# EAGLE design PLCC32 programmer (EAGLE 9.1.0)
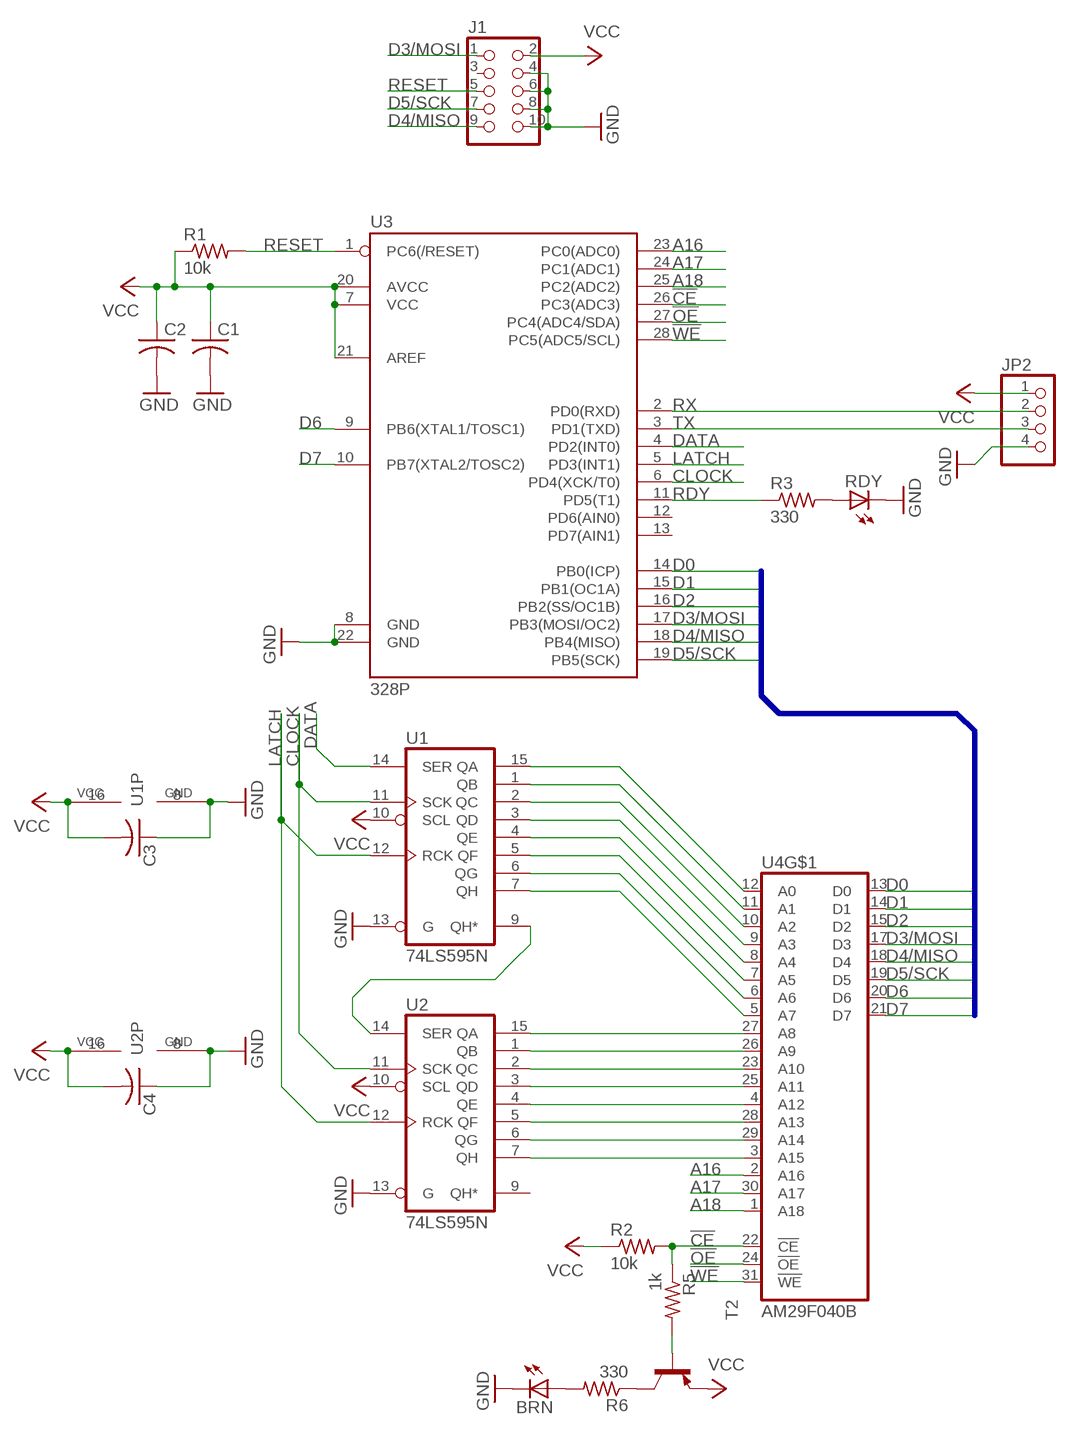
[diagram p0: schematic, sheet 1]

## Parts
BRN  LED5MM  [LED5MM]
C1  C-US025-024X044  [C025-024X044]
C2  C-US025-024X044  [C025-024X044]
C3  C-US025-024X044  [C025-024X044]
C4  C-US025-024X044  [C025-024X044]
J1  CON_HEADER_2X05-PTH+SHROUDED_A  [PINSHRD_PTH_2X05]
JP2  PINHD-1X4/OCT  [1X04/OCT]
R1  10k  R-US_0204/7  [0204/7]
R2  10k  R-US_0204/7  [0204/7]
R3  330  R-US_0204/7  [0204/7]
R5  1k  R-US_0204/7  [0204/7]
R6  330  R-US_0204/7  [0204/7]
RDY  LED5MM  [LED5MM]
T2  BC558A-PNP-TO92-EBC  [TO92-EBC]
U1  74LS595N  [DIL16]
U2  74LS595N  [DIL16]
U3  328P  ATMEGA328P_PDIP  [DIP28]
U4  AM29F040B  [PLCC-32-SMT-TT]

## Nets
!CE: R2.2 R5.1 U3.26(PC3(ADC3)) U4.22(!CE)
!OE: U3.27(PC4(ADC4/SDA)) U4.24(!OE)
!WE: U3.28(PC5(ADC5/SCL)) U4.31(!WE)
A16: U3.23(PC0(ADC0)) U4.2(A16)
A17: U3.24(PC1(ADC1)) U4.30(A17)
A18: U3.25(PC2(ADC2)) U4.1(A18)
CLOCK: U1.11(SCK) U2.11(SCK) U3.6(PD4(XCK/T0))
D0: U3.14(PB0(ICP)) U4.13(D0)
D1: U3.15(PB1(OC1A)) U4.14(D1)
D2: U3.16(PB2(SS/OC1B)) U4.15(D2)
D3/MOSI: J1.1 U3.17(PB3(MOSI/OC2)) U4.17(D3)
D4/MISO: J1.9 U3.18(PB4(MISO)) U4.18(D4)
D5/SCK: J1.7 U3.19(PB5(SCK)) U4.19(D5)
D6: U3.9(PB6(XTAL1/TOSC1)) U4.20(D6)
D7: U3.10(PB7(XTAL2/TOSC2)) U4.21(D7)
DATA: U1.14(SER) U3.4(PD2(INT0))
GND: BRN.K(C) C1.2 C2.2 C3.1 C4.1 J1.4 J1.6 J1.8 J1.10 JP2.4 RDY.K(C) U1.8(GND) U1.13(G) U2.8(GND) U2.13(G) U3.8(GND) U3.22(GND)
LATCH: U1.12(RCK) U2.12(RCK) U3.5(PD3(INT1))
N$1: U1.9(QH*) U2.14(SER)
N$2: U1.15(QA) U4.12(A0)
N$3: U1.1(QB) U4.11(A1)
N$4: U1.2(QC) U4.10(A2)
N$5: U1.3(QD) U4.9(A3)
N$6: U1.4(QE) U4.8(A4)
N$7: U1.5(QF) U4.7(A5)
N$8: U1.6(QG) U4.6(A6)
N$9: U1.7(QH) U4.5(A7)
N$10: U2.15(QA) U4.27(A8)
N$11: U2.1(QB) U4.26(A9)
N$12: U2.2(QC) U4.23(A10)
N$13: U2.3(QD) U4.25(A11)
N$14: U2.4(QE) U4.4(A12)
N$15: U2.5(QF) U4.28(A13)
N$16: U2.6(QG) U4.29(A14)
N$17: U2.7(QH) U4.3(A15)
N$18: R3.2 RDY.A
N$22: R6.1 T2.C
N$23: BRN.A R6.2
N$24: R5.2 T2.B
RDY: R3.1 U3.11(PD5(T1))
RESET: J1.5 R1.2 U3.1(PC6(/RESET))
RX: JP2.2 U3.2(PD0(RXD))
TX: JP2.3 U3.3(PD1(TXD))
VCC: C1.1 C2.1 C3.2 C4.2 J1.2 JP2.1 R1.1 R2.1 T2.E U1.10(SCL) U1.16(VCC) U2.10(SCL) U2.16(VCC) U3.7(VCC) U3.20(AVCC) U3.21(AREF)
Unconnected: J1.3 U2.9(QH*) U3.12(PD6(AIN0)) U3.13(PD7(AIN1))

## Buses
D0,D1,D2,D3/MOSI,D4/MISO,D5/SCK,D6,D7

## Power pins joined to a net without a drawn wire
GND: U4.16(GND)
VCC: U4.32(VCC)

## Library data of the parts
BRN RDY = led:LED: LED OSRAM: - CHIPLED LG R971, LG N971, LY N971, LG Q971, LY Q971, LO R971, LY R971 LH N974, LH R974 LS Q976, LO Q976, LY Q976 LO Q996 - Hyper CHIPLED LW Q18S LB Q993, LB Q99A, LB R99A - SideLED LS A670, LO A670, LY A670, LG A670, LP A670 LB A673, LV A673, LT A673, LW A673 LH A674 LY A675 LS A676, LA A676, LO A676, LY A676, LW A676 LS A679, LY A679, LG A679 - Hyper Micro SIDELED® LS Y876, LA Y876, LO Y876, LY Y876 LT Y87S - SmartLED LW L88C, LW L88S LB L89C, LB L89S, LG L890 LS L89K, LO L89K, LY L89K LS L896, LA L896, LO L896, LY L896 - TOPLED LS T670, LO T670, LY T670, LG T670, LP T670 LSG T670, LSP T670, LSY T670, LOP T670, LYG T670 LG T671, LOG T671, LSG T671 LB T673, LV T673, LT T673, LW T673 LH T674 LS T676, LA T676, LO T676, LY T676, LB T676, LH T676, LSB T676, LW T676 LB T67C, LV T67C, LT T67C, LS T67K, LO T67K, LY T67K, LW E67C LS E67B, LA E67B, LO E67B, LY E67B, LB E67C, LV E67C, LT E67C LW T67C LS T679, LY T679, LG T679 LS T770, LO T770, LY T770, LG T770, LP T770 LB T773, LV T773, LT T773, LW T773 LH T774 LS E675, LA E675, LY E675, LS T675 LS T776, LA T776, LO T776, LY T776, LB T776 LHGB T686 LT T68C, LB T68C - Hyper Mini TOPLED® LB M676 - Mini TOPLED Santana® LG M470 LS M47K, LO M47K, LY M47K Source: http://www.osram.convergy.de LUXEON: - LUMILED® LXK2-PW12-R00, LXK2-PW12-S00, LXK2-PW14-U00, LXK2-PW14-V00 LXK2-PM12-R00, LXK2-PM12-S00, LXK2-PM14-U00 LXK2-PE12-Q00, LXK2-PE12-R00, LXK2-PE12-S00, LXK2-PE14-T00, LXK2-PE14-U00 LXK2-PB12-K00, LXK2-PB12-L00, LXK2-PB12-M00, LXK2-PB14-N00, LXK2-PB14-P00, LXK2-PB14-Q00 LXK2-PR12-L00, LXK2-PR12-M00, LXK2-PR14-Q00, LXK2-PR14-R00 LXK2-PD12-Q00, LXK2-PD12-R00, LXK2-PD12-S00 LXK2-PH12-R00, LXK2-PH12-S00 LXK2-PL12-P00, LXK2-PL12-Q00, LXK2-PL12-R00 Source: www.luxeon.com KINGBRIGHT: KA-3528ASYC Source: www.kingbright.com
C1-C4 = rcl:C-US: CAPACITOR, American symbol
J1 = dp_devices.v6:CON_HEADER_2X05: 2x05 pin header
JP2 = pinhead_v2:PINHD-1X4: PIN HEADER
R1-R3 R5 R6 = rcl:R-US_: RESISTOR, American symbol
T2 = transistor:*-PNP-: PNP Transistror
U1 = 74xx-us:74*595: 8-bit SHIFT REGISTER, output latch; SPICEPREFIX: X
U2 = 74xx-us:74*595: 8-bit SHIFT REGISTER, output latch
U3 = SparkFun-IC-Microcontroller:ATMEGA328P_PDIP: Atmel 328P Through hole ATMEGA328P uC used in the Arduino 32kb flash, 1k EEPROM, 2k SRAM Datasheet <http://www.sparkfun.com/datasheets/Components/SMD/ATMega328.pdf> SparkFun Products Storefront component: AVR 28 Pin 20MHz 32K 6A/D - ATMega328P <https://www.sparkfun.com/products/9061> (COM-09061) SparkFun Simon Says - Through-Hole Soldering Kit <https://www.sparkfun.com/products/10547> (KIT-10547) SparkFun Learn to Solder - Simon Says <https://www.sparkfun.com/products/13708> (KIT-13708) SparkFun BigTime Watch Kit <https://www.sparkfun.com/products/11734> (KIT-11734) SparkFun ClockIt <https://www.sparkfun.com/products/10930> (KIT-10930) SparkFun Serial Enabled LCD Kit <https://www.sparkfun.com/products/10097> (LCD-10097) SparkFun Simon Tilts - Through Hole Soldering Kit <https://www.sparkfun.com/products/12634> (KIT-12634) SparkFun Frequency Counter Kit <https://www.sparkfun.com/products/10140> (KIT-10140) FabFM Radio Kit <https://www.sparkfun.com/products/11043> (KIT-11043) SparkFun Binary Blaster Kit <https://www.sparkfun.com/products/12037> (KIT-12037) SparkFun Metro-Gnome <https://www.sparkfun.com/products/9236> (KIT-09236) ATmega328 with Arduino Optiboot (Uno) <https://www.sparkfun.com/products/10524> (DEV-10524); PROD_ID: IC-09136
U4 = am29F32B:AM29F040B

## Board
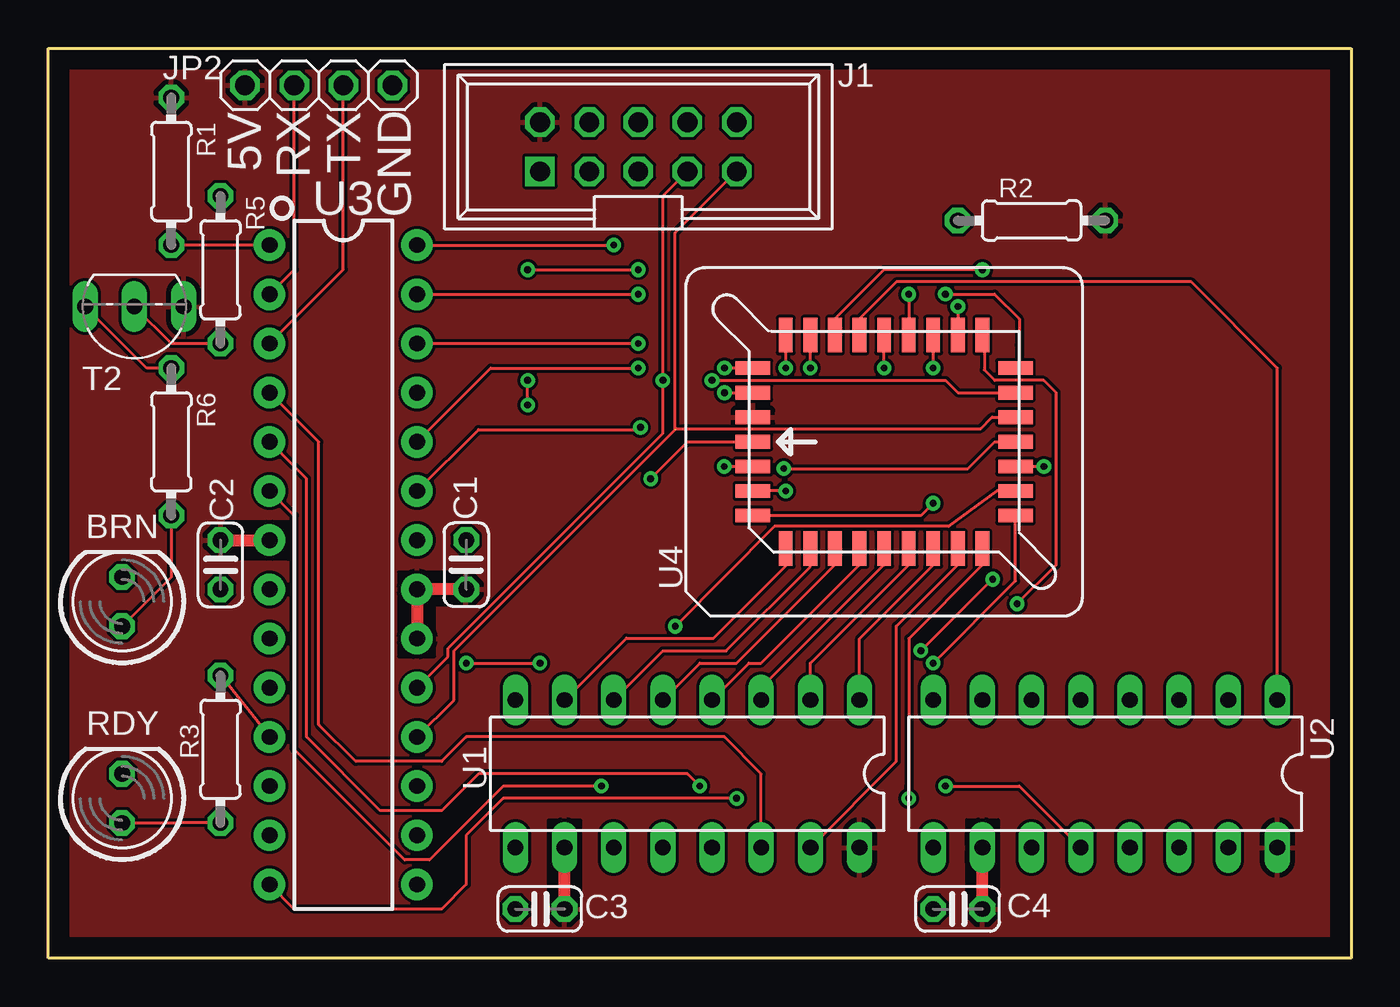
[diagram p1: board, top side]
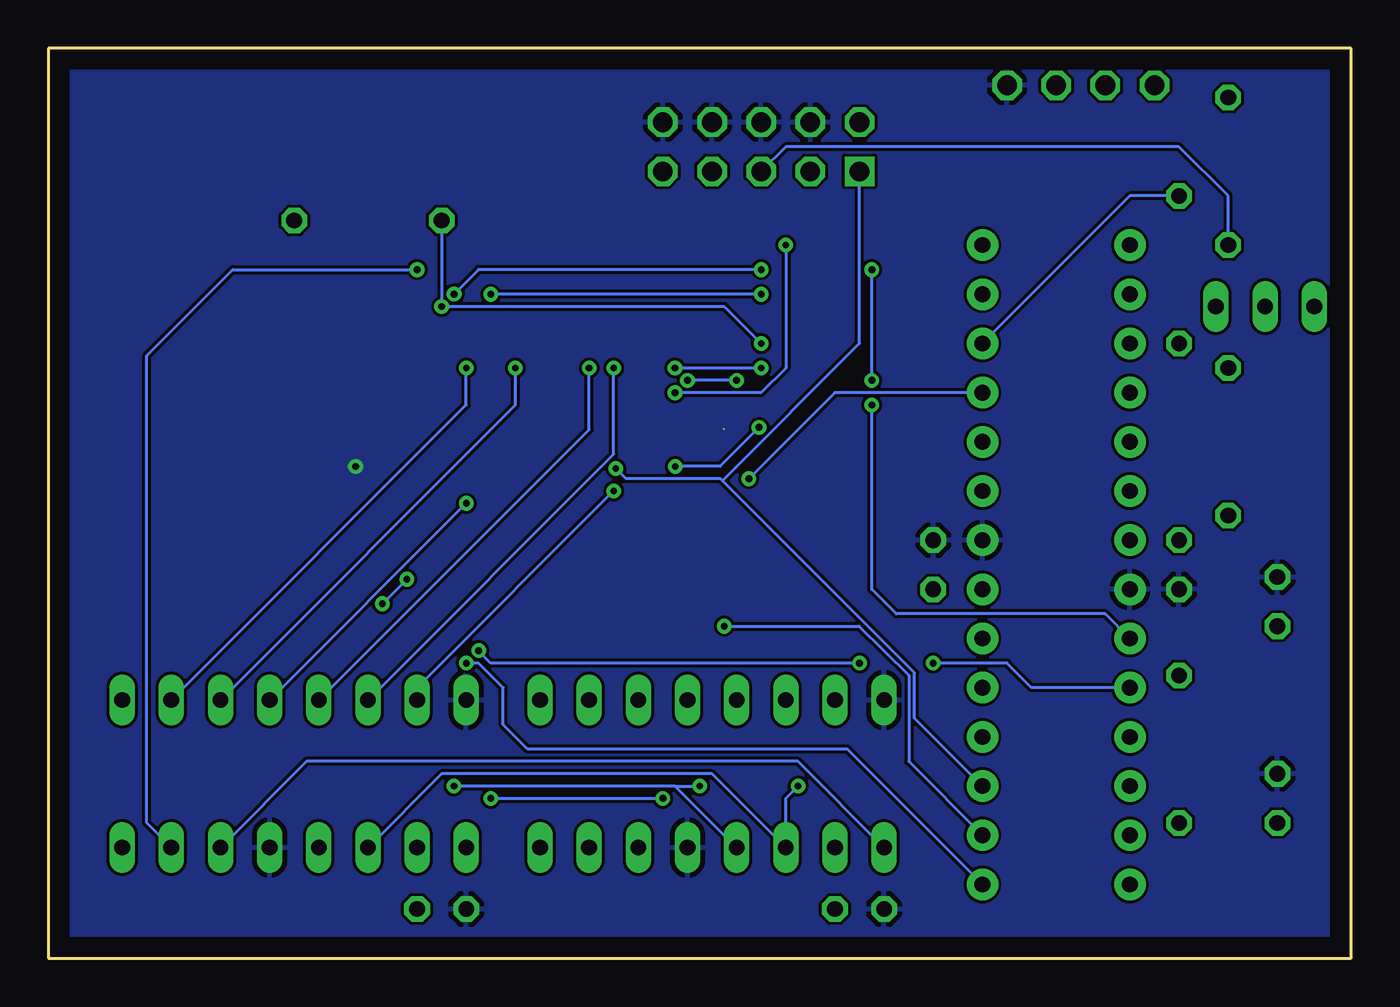
[diagram p2: board, bottom side, seen from below]

Size 67.31 x 46.99 mm. Coordinates in mm from the lower left corner, seen from the top.
Outline: 0,0 0,46.99 67.31,46.99 67.31,0 0,0
Copper layers (1*16): Top 0.035mm / dielectric 1.5mm / Bottom 0.035mm
Design rules "default": minimum track width 6mil, minimum drill 0.35mm, track to track 6mil, track to pad 6mil, pad to pad 6mil, via to via 6mil, smd to smd 6mil, copper to edge 40mil, drill to drill 6mil, minimum pad ring 10mil, minimum via ring 8mil, stop-mask expansion 4mil, vias tented up to drill 0mil, thermal gap 10mil

### Footprints (pad centres in the part's own frame; a part is rotated, then mirrored left to right if it is on the bottom)
LED5MM = drill 0.813 octagon: A -1.27,0; K 1.27,0
C025-024X044 = drill 0.813 octagon: 1 -1.27,0; 2 1.27,0
PINSHRD_PTH_2X05 = drill 1.016 square: 1 -5.08,-1.27 | drill 1.016 octagon: 2 -5.08,1.27; 3 -2.54,-1.27; 4 -2.54,1.27; 5 0,-1.27; 6 0,1.27; 7 2.54,-1.27; 8 2.54,1.27; 9 5.08,-1.27; 10 5.08,1.27
1X04/OCT = drill 1.016 octagon: 1 -3.81,0; 2 -1.27,0; 3 1.27,0; 4 3.81,0
0204/7 = drill 0.813 octagon: 1 -3.81,0; 2 3.81,0
TO92-EBC = drill 0.813 long: B 0,-1.27; C 2.54,-1.27; E -2.54,-1.27
DIL16 = drill 0.813 long: 1 -8.89,-3.81; 2 -6.35,-3.81; 3 -3.81,-3.81; 4 -1.27,-3.81; 5 1.27,-3.81; 6 3.81,-3.81; 7 6.35,-3.81; 8 8.89,-3.81; 9 8.89,3.81; 10 6.35,3.81; 11 3.81,3.81; 12 1.27,3.81; 13 -1.27,3.81; 14 -3.81,3.81; 15 -6.35,3.81; 16 -8.89,3.81
DIP28 = drill 0.813 pad 1.626: 1 -16.51,-3.81; 2 -13.97,-3.81; 3 -11.43,-3.81; 4 -8.89,-3.81; 5 -6.35,-3.81; 6 -3.81,-3.81; 7 -1.27,-3.81; 8 1.27,-3.81; 9 3.81,-3.81; 10 6.35,-3.81; 11 8.89,-3.81; 12 11.43,-3.81; 13 13.97,-3.81; 14 16.51,-3.81; 15 16.51,3.81; 16 13.97,3.81; 17 11.43,3.81; 18 8.89,3.81; 19 6.35,3.81; 20 3.81,3.81; 21 1.27,3.81; 22 -1.27,3.81; 23 -3.81,3.81; 24 -6.35,3.81; 25 -8.89,3.81; 26 -11.43,3.81; 27 -13.97,3.81; 28 -16.51,3.81
PLCC-32-SMT-TT = smd 0.71 x 1.78: 1 0,6.785; 2 -1.27,6.785; 3 -2.54,6.785; 4 -3.81,6.785; 14 -3.81,-6.785; 15 -2.54,-6.785; 16 -1.27,-6.785; 17 0,-6.785; 18 1.27,-6.785; 19 2.54,-6.785; 20 3.81,-6.785; 30 3.81,6.785; 31 2.54,6.785; 32 1.27,6.785 | smd 1.78 x 0.71: 5 -5.515,5.08; 6 -5.515,3.81; 7 -5.515,2.54; 8 -5.515,1.27; 9 -5.515,0; 10 -5.515,-1.27; 11 -5.515,-2.54; 12 -5.515,-3.81; 13 -5.515,-5.08; 21 5.515,-5.08; 22 5.515,-3.81; 23 5.515,-2.54; 24 5.515,-1.27; 25 5.515,0; 26 5.515,1.27; 27 5.515,2.54; 28 5.515,3.81; 29 5.515,5.08

### Placement (x,y rotation side)
BRN  3.81,18.41 90 top
C1  21.59,20.32 90 top
C2  8.89,20.32 270 top
C3  25.4,2.54 0 top
C4  46.99,2.54 0 top
J1  30.48,41.91 0 top
JP2  13.97,45.09 0 top
R1  6.35,40.64 270 top
R2  50.8,38.1 180 top
R3  8.89,10.79 270 top
R5  8.89,35.56 270 top
R6  6.35,26.67 270 top
RDY  3.81,8.26 90 top
T2  4.45,32.38 180 top
U1  33.02,9.53 180 top
U2  54.61,9.53 180 top
U3  15.24,20.32 270 top
U4  43.18,26.67 90 top

### Tracks (layer width: path | path; a pad name or v marks a point on that pad's centre or on a via)
!CE  (via drill 0.35)
  Top 0.152: v46.99,33.66 U4.22 | U3.26 v30.48,31.75
  Bottom 0.152: R5.1 11.43,39.37 U3.26 | R2.2 v46.99,33.66 32.38,33.66 v30.48,31.75
!OE  (via drill 0.35)
  Top 0.152: U3.27 v30.48,34.29 | v44.45,34.29 U4.24
  Bottom 0.152: v30.48,34.29 v44.45,34.29
!WE  (via drill 0.35)
  Top 0.152: U3.28 v29.21,36.83 | v34.93,29.2 v34.94,29.21 U4.31
  Bottom 0.152: v29.21,36.83 29.21,30.48 30.48,29.21 v34.92,29.21 v34.93,29.2
A16  (via drill 0.35)
  Top 0.152: U3.23 22.23,27.3 30.48,27.3 v30.59,27.42 | v34.92,25.4 U4.2
  Bottom 0.152: v30.59,27.42 32.61,25.4 v34.92,25.4
A17  (via drill 0.35)
  Top 0.152: U3.24 22.86,30.48 v30.48,30.48 | v34.93,30.49 U4.30
  Bottom 0.152: v30.48,30.48 v34.92,30.48 v34.93,30.49
A18  (via drill 0.35)
  Top 0.152: v31.11,24.77 33.02,26.67 U4.1
  Bottom 0.152: U3.25 26.67,29.21 v31.11,24.77
BLAH2
  cutout Top: 25.83,2.77 25.83,7.14 27.51,7.14 27.51,2.82 27.51,2.74 25.81,2.74 25.81,2.77
  cutout Top: 47.45,2.82 47.45,7.16 49.07,7.16 49.07,2.82
  cutout Top: 21.36,19.84 21.36,19.94 18.08,19.94 18.08,15.57 19.96,15.57 19.96,18.26 21.34,18.26 21.34,19.79 21.34,19.89 21.34,19.94
  cutout Top: 9.17,22.56 12.34,22.56 12.34,20.6 9.17,20.6
CLOCK  (via drill 0.35)
  Top 0.152: v28.57,8.89 23.5,8.89 19.68,5.08 18.41,5.08 12.7,10.79 12.7,22.86 U3.6
  Bottom 0.152: U2.11 46.99,9.53 33.02,9.53 U1.11 29.21,8.26 v28.57,8.89
D0  (via drill 0.35)
  Top 0.152: U4.13 48.26,20.32 44.45,16.51 44.45,8.89 v44.45,8.26 | v35.56,8.26 23.5,8.26 21.59,6.35 21.59,3.81 20.32,2.54 12.7,2.54 U3.14
  Bottom 0.152: v44.45,8.26 v35.56,8.26
D1  (via drill 0.35)
  Top 0.152: v45.72,15.24 49.97,19.48 U4.14
  Bottom 0.152: U3.15 26.04,10.79 42.55,10.79 43.81,12.06 43.81,13.97 45.09,15.24 v45.72,15.24
D2  (via drill 0.35)
  Top 0.152: U4.15 49,24.13 46.51,22.3 37.52,22.3 v32.39,17.15
  Bottom 0.152: v32.39,17.15 25.43,17.15 22.86,14.61 22.86,10.16 U3.16
D3/MOSI  (via drill 0.35)
  Top 0.152: v37.99,25.29 47.51,25.29 48.9,26.67 U4.17
  Bottom 0.152: U3.17 22.55,12.39 22.55,14.73 32.49,24.66 | 32.49,24.66 32.59,24.77 37.47,24.77 v37.99,25.29 | v37.99,25.29 38.1,25.4 v37.99,25.29 | 32.49,24.66 25.4,31.75 J1.1
D4/MISO  (1 unrouted)
  Top 0.152: U4.18 48.76,27.94 48.17,27.36 32.44,27.36 | J1.9 32.38,37.47 32.38,27.3 20.95,15.88 20.95,13.34 U3.18
D5/SCK  (via drill 0.35)
  Top 0.152: U3.19 20.65,15.57 20.65,16 31.75,27.1 v31.75,29.84 31.75,39.37 J1.7 | v34.29,29.84 46.35,29.84 46.99,29.21 U4.19
  Bottom 0.152: v31.75,29.84 v34.29,29.84
D6  (via drill 0.35)
  Top 0.152: v24.77,28.57 v24.77,29.84 | v24.77,35.56 v30.48,35.56 | v46.35,34.3 48.89,34.3 50.16,33.02 50.16,31.68 50.16,30.68 U4.20
  Bottom 0.152: U3.9 12.7,17.78 23.5,17.78 24.77,19.05 v24.77,28.57 | v24.77,29.84 v24.77,35.56 | v30.48,35.56 45.09,35.56 v46.35,34.3 | v46.35,34.3 v46.35,34.29 v46.35,34.3
D7  (via drill 0.35)
  Top 0.152: v21.59,15.24 v25.4,15.24 | v45.08,15.88 48.88,19.68 48.9,19.68 v48.78,19.57 | v50.05,18.3 52.07,20.32 52.07,29.21 51.43,29.85 48.89,29.85 48.36,30.38 48.36,32.28 | 48.46,32.38 48.36,32.28 | 48.36,32.28 U4.21
  Bottom 0.152: U3.10 16.51,13.97 17.78,15.24 v21.59,15.24 | v25.4,15.24 44.45,15.24 v45.09,15.88 v45.08,15.88 | v48.78,19.57 49.94,18.41 50.16,18.41 v50.05,18.3
DATA
  Top 0.152: U1.14 36.83,9.53 34.92,11.43 21.59,11.43 20.32,10.16 15.88,10.16 13.97,12.06 13.97,26.67 U3.4
GND  (via drill 0.35)
  Top 0.152: 50.8,25.4 U4.16 v51.44,25.4
  pour Bottom: 0,0 0,46.99 67.31,46.99 67.31,0
LATCH  (via drill 0.35)
  Top 0.152: v46.35,8.89 50.16,8.89 U2.12 | v33.66,8.89 33.02,9.53 22.23,9.53 20.32,7.62 17.14,7.62 13.34,11.43 13.34,24.77 U3.5
  Bottom 0.152: U1.12 34.92,8.89 | 34.92,8.89 v46.35,8.89 | 34.92,8.89 v33.66,8.89
N$1
  Bottom 0.152: U1.9 28.57,10.16 53.98,10.16 U2.14
N$2
  Top 0.152: U1.15 43.81,10.16 43.81,17.14 46.99,20.32 U4.12
N$3
  Top 0.152: U4.11 45.72,20.32 41.91,16.51 U1.1
N$4
  Top 0.152: U4.10 44.45,20.32 39.37,15.24 U1.2
N$5
  Top 0.152: U4.9 43.18,20.32 36.83,13.97 U1.3
N$6
  Top 0.152: U1.4 36.2,15.24 36.83,15.24 41.91,20.32 U4.8
N$7
  Top 0.152: U1.5 33.66,15.24 35.56,15.24 40.64,20.32 U4.7
N$8
  Top 0.152: U1.6 31.75,15.88 35.02,15.88 39.37,20.22 U4.6
N$9
  Top 0.152: U1.7 29.87,16.53 34.37,16.53 38.1,20.27 U4.5
N$10  (via drill 0.35)
  Top 0.152: v48.26,35.56 43.18,35.56 40.64,33.02 U4.27
  Bottom 0.152: U2.15 62.23,6.99 62.23,31.11 57.78,35.56 v48.26,35.56
N$11
  Top 0.152: U2.1 63.5,30.48 59.05,34.92 43.81,34.92 41.91,33.02 U4.26
N$12  (via drill 0.35)
  Top 0.152: v45.72,30.48 U4.23
  Bottom 0.152: U2.2 45.72,28.57 v45.72,30.48
N$13  (via drill 0.35)
  Top 0.152: v43.18,30.48 U4.25
  Bottom 0.152: U2.3 43.18,28.57 v43.18,30.48
N$14  (via drill 0.35)
  Top 0.152: U4.4 45.09,22.86 v45.72,23.5
  Bottom 0.152: U2.4 v45.72,23.5
N$15  (via drill 0.35)
  Top 0.152: v39.37,30.48 U4.28
  Bottom 0.152: U2.5 39.37,27.3 v39.37,30.48
N$16  (via drill 0.35)
  Top 0.152: v38.1,30.48 U4.29
  Bottom 0.152: U2.6 38.1,26.04 v38.1,30.48
N$17  (via drill 0.35)
  Top 0.152: v38.1,24.13 U4.3
  Bottom 0.152: U2.7 48.26,13.97 v38.1,24.13
N$18
  Top 0.152: RDY.A 6.68,6.99 R3.2
N$22
  Top 0.152: R6.1 5.08,30.48 T2.C
N$23
  Top 0.152: R6.2 6.35,19.68 BRN.A
N$24
  Top 0.152: T2.B 6.35,31.75 R5.2
RDY
  Top 0.152: U3.11 R3.1
RESET
  Top 0.152: U3.1 R1.2
  Bottom 0.152: R1.2 6.35,39.37 8.89,41.91 29.21,41.91 J1.5
RX
  Top 0.152: U3.2 12.7,35.56 JP2.2
TX
  Top 0.152: U3.3 15.24,35.56 JP2.3
VCC
  Top 0.61: C3.2 U1.10 | C4.2 U2.10 | C1.1 U3.21 U3.20 | C2.1 U3.7
  pour Top: 0,0 0,46.99 67.31,46.99 67.31,0

### Text on the board
tPlace: 5V | RX | TX | GND